# EAGLE design clock (EAGLE 6.5.0)
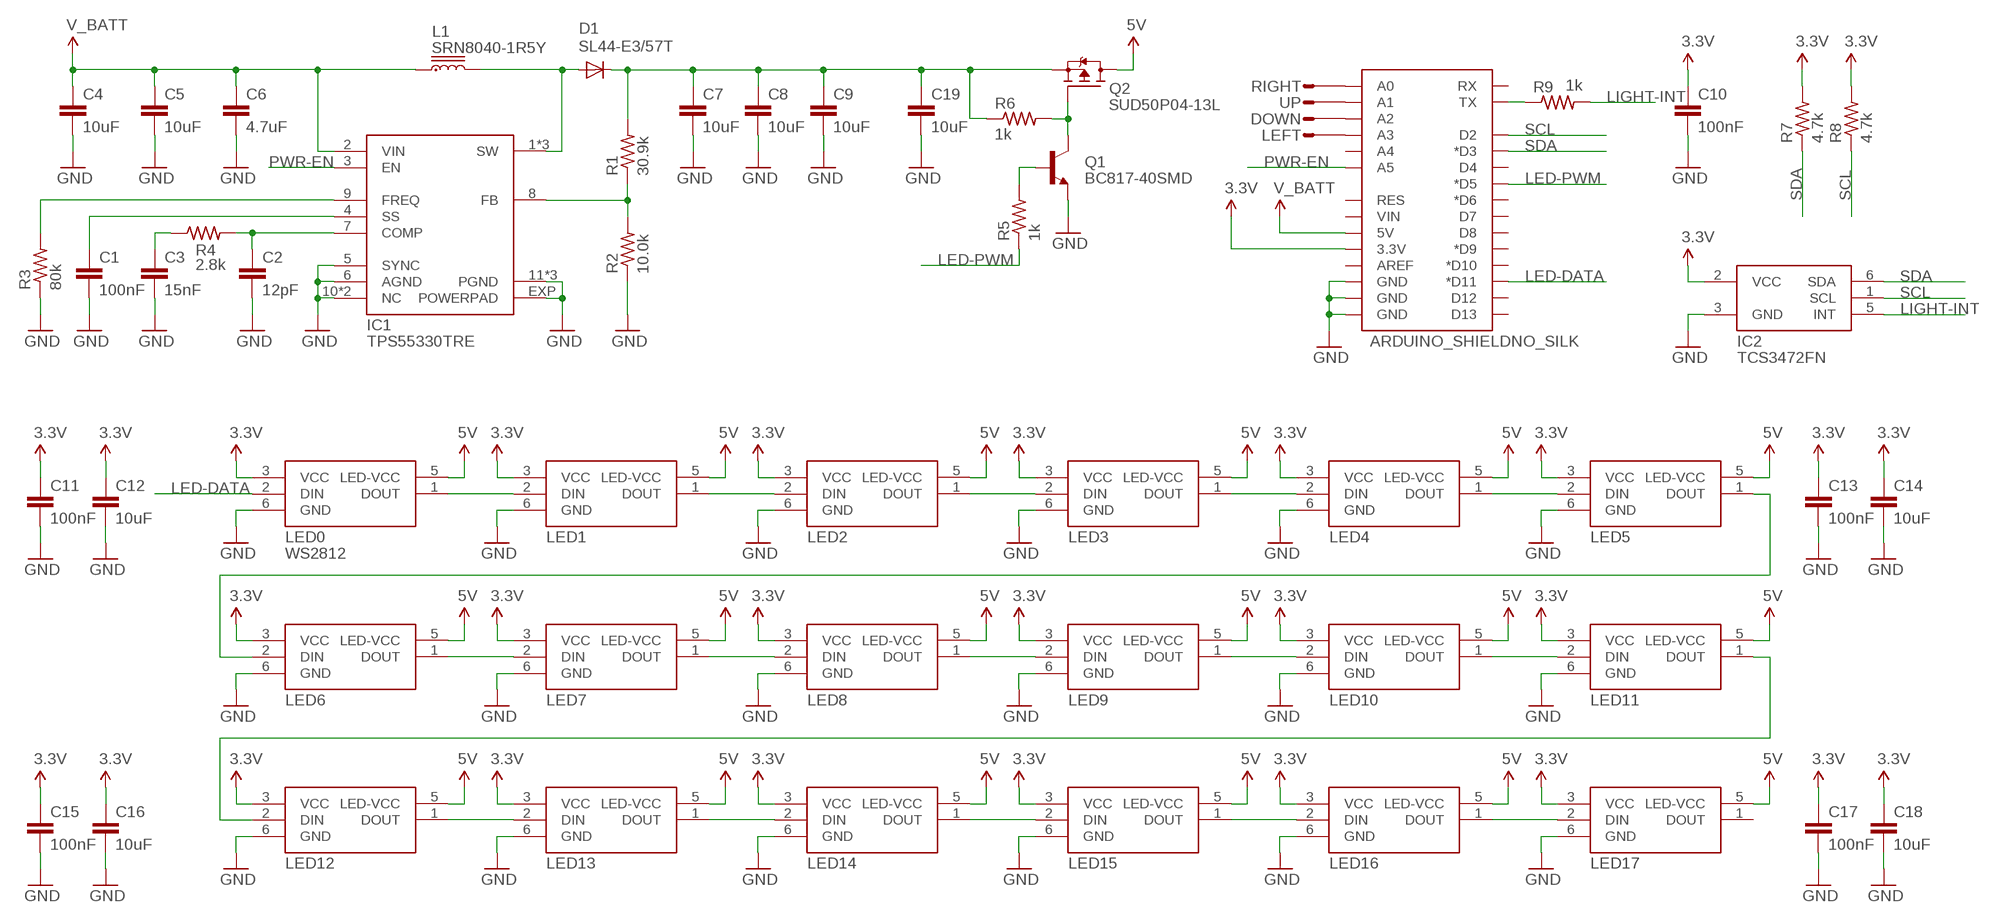
[diagram p0: schematic, sheet 1]

## Parts
C1  100nF  C-EUC0603K  [C0603K]
C2  12pF  C-EUC0603K  [C0603K]
C3  15nF  C-EUC0603K  [C0603K]
C4  10uF  C-EUC1206K  [C1206K]
C5  10uF  C-EUC1206K  [C1206K]
C6  4.7uF  C-EUC0805K  [C0805K]
C7  10uF  C-EUC1206K  [C1206K]
C8  10uF  C-EUC1206K  [C1206K]
C9  10uF  C-EUC1206K  [C1206K]
C10  100nF  C-EUC0603K  [C0603K]
C11  100nF  C-EUC0603K  [C0603K]
C12  10uF  C-EUC1206K  [C1206K]
C13  100nF  C-EUC0603K  [C0603K]
C14  10uF  C-EUC1206K  [C1206K]
C15  100nF  C-EUC0603K  [C0603K]
C16  10uF  C-EUC1206K  [C1206K]
C17  100nF  C-EUC0603K  [C0603K]
C18  10uF  C-EUC1206K  [C1206K]
C19  10uF  C-EUC1206K  [C1206K]
CN1  ARDUINO_SHIELDNO_SILK  [DUEMILANOVE_VIAS]
D1  SL44-E3/57T  DIODE-SMC  [SMC]
DOWN  CAP-PAD15MM  [CAP-PAD-15MM]
IC1  TPS55330TRE  [QFN16]
IC2  TCS3472FN  [DFN-6]
L1  SRN8040-1R5Y  SRN8040  [SRN8040]
LED0  WS2812  [LED-TRICOLOR-5050-IC]
LED1  WS2812  [LED-TRICOLOR-5050-IC]
LED2  WS2812  [LED-TRICOLOR-5050-IC]
LED3  WS2812  [LED-TRICOLOR-5050-IC]
LED4  WS2812  [LED-TRICOLOR-5050-IC]
LED5  WS2812  [LED-TRICOLOR-5050-IC]
LED6  WS2812  [LED-TRICOLOR-5050-IC]
LED7  WS2812  [LED-TRICOLOR-5050-IC]
LED8  WS2812  [LED-TRICOLOR-5050-IC]
LED9  WS2812  [LED-TRICOLOR-5050-IC]
LED10  WS2812  [LED-TRICOLOR-5050-IC]
LED11  WS2812  [LED-TRICOLOR-5050-IC]
LED12  WS2812  [LED-TRICOLOR-5050-IC]
LED13  WS2812  [LED-TRICOLOR-5050-IC]
LED14  WS2812  [LED-TRICOLOR-5050-IC]
LED15  WS2812  [LED-TRICOLOR-5050-IC]
LED16  WS2812  [LED-TRICOLOR-5050-IC]
LED17  WS2812  [LED-TRICOLOR-5050-IC]
LEFT  CAP-PAD15MM  [CAP-PAD-15MM]
Q1  BC817-40SMD  [SOT23-BEC]
Q2  SUD50P04-13L  FDD4141TO252  [TO252]
R1  30.9k  R-US_R0603  [R0603]
R2  10.0k  R-US_R0603  [R0603]
R3  80k  R-US_R0603  [R0603]
R4  2.8k  R-US_R0603  [R0603]
R5  1k  R-US_R0603  [R0603]
R6  1k  R-US_R0603  [R0603]
R7  4.7k  R-US_R0603  [R0603]
R8  4.7k  R-US_R0603  [R0603]
R9  1k  R-US_R0603  [R0603]
RIGHT  CAP-PAD15MM  [CAP-PAD-15MM]
UP  CAP-PAD15MM  [CAP-PAD-15MM]

## Nets
3.3V: C10.1 C11.1 C12.1 C13.1 C14.1 C15.1 C16.1 C17.1 C18.1 CN1.3.3V IC2.2(VCC) LED0.3(VCC) LED1.3(VCC) LED2.3(VCC) LED3.3(VCC) LED4.3(VCC) LED5.3(VCC) LED6.3(VCC) LED7.3(VCC) LED8.3(VCC) LED9.3(VCC) LED10.3(VCC) LED11.3(VCC) LED12.3(VCC) LED13.3(VCC) LED14.3(VCC) LED15.3(VCC) LED16.3(VCC) LED17.3(VCC) R7.2 R8.2
5V: LED0.5(LED-VCC) LED1.5(LED-VCC) LED2.5(LED-VCC) LED3.5(LED-VCC) LED4.5(LED-VCC) LED5.5(LED-VCC) LED6.5(LED-VCC) LED7.5(LED-VCC) LED8.5(LED-VCC) LED9.5(LED-VCC) LED10.5(LED-VCC) LED11.5(LED-VCC) LED12.5(LED-VCC) LED13.5(LED-VCC) LED14.5(LED-VCC) LED15.5(LED-VCC) LED16.5(LED-VCC) LED17.5(LED-VCC) Q2.3(D)
COMP: C2.1 IC1.7(COMP) R4.2
FB: IC1.8(FB) R1.1 R2.2
FREQ: IC1.9(FREQ) R3.2
GND: C1.2 C2.2 C3.2 C4.2 C5.2 C6.2 C7.2 C8.2 C9.2 C10.2 C11.2 C12.2 C13.2 C14.2 C15.2 C16.2 C17.2 C18.2 C19.2 CN1.GND@0(GND) CN1.GND@1(GND) CN1.GND@2(GND) IC1.5(SYNC) IC1.6(AGND) IC1.10(NC) IC1.11(PGND) IC1.12(PGND) IC1.13(PGND) IC1.14(NC) IC1.EXP(POWERPAD) IC2.3(GND) LED0.6(GND) LED1.6(GND) LED2.6(GND) LED3.6(GND) LED4.6(GND) LED5.6(GND) LED6.6(GND) LED7.6(GND) LED8.6(GND) LED9.6(GND) LED10.6(GND) LED11.6(GND) LED12.6(GND) LED13.6(GND) LED14.6(GND) LED15.6(GND) LED16.6(GND) LED17.6(GND) Q1.E R2.1 R3.1
LED12: LED12.1(DOUT) LED13.2(DIN)
LED15: LED14.1(DOUT) LED15.2(DIN)
LED-DATA: CN1.D11(*D11) LED0.2(DIN)
LED-PWM: CN1.D5(*D5) R5.1
LIGHT-INT: IC2.5(INT) R9.2
N$1: CN1.A3 LEFT.P$1
N$2: CN1.A2 DOWN.P$1
N$3: CN1.A1 UP.P$1
N$4: CN1.A0 RIGHT.P$1
N$5: LED0.1(DOUT) LED1.2(DIN)
N$6: CN1.TX R9.1
N$7: C3.1 R4.1
N$8: Q1.B R5.2
N$9: Q1.C Q2.1(G) R6.2
N$10: LED1.1(DOUT) LED2.2(DIN)
N$11: LED2.1(DOUT) LED3.2(DIN)
N$12: LED3.1(DOUT) LED4.2(DIN)
N$13: LED4.1(DOUT) LED5.2(DIN)
N$14: LED6.1(DOUT) LED7.2(DIN)
N$15: LED7.1(DOUT) LED8.2(DIN)
N$16: LED8.1(DOUT) LED9.2(DIN)
N$17: LED9.1(DOUT) LED10.2(DIN)
N$18: LED10.1(DOUT) LED11.2(DIN)
N$19: LED5.1(DOUT) LED6.2(DIN)
N$21: LED13.1(DOUT) LED14.2(DIN)
N$23: LED15.1(DOUT) LED16.2(DIN)
N$24: LED16.1(DOUT) LED17.2(DIN)
N$25: LED11.1(DOUT) LED12.2(DIN)
PWR-EN: CN1.A5 IC1.3(EN)
SCL: CN1.D2 IC2.1(SCL) R8.1
SDA: CN1.D3(*D3) IC2.6(SDA) R7.1
SMPSU-OUTPUT: C7.1 C8.1 C9.1 C19.1 D1.C Q2.2(S) R1.2 R6.1
SS: C1.1 IC1.4(SS)
SW: D1.A IC1.1(SW) IC1.15(SW) IC1.16(SW) L1.P$2
V_BATT: C4.1 C5.1 C6.1 CN1.5V IC1.2(VIN) L1.P$1
Unconnected: CN1.A4 CN1.AREF CN1.D4 CN1.D6(*D6) CN1.D7 CN1.D8 CN1.D9(*D9) CN1.D10(*D10) CN1.D12 CN1.D13 CN1.RES CN1.RX CN1.VIN LED17.1(DOUT)

## Library data of the parts
C1-C19 = rcl:C-EU: CAPACITOR, European symbol
CN1 = SparkFun-Boards:ARDUINO_SHIELD: Arduino shield footprint
D1 = diode:DIODE-: DIODE
DOWN LEFT RIGHT UP = HyperTriangle:CAP-PAD: Capacitive Pad
IC1 = HyperTriangle:TPS55330: The TPS55330 is a monolithic non-synchronous switching regulator with integrated 5-A, 24-V power switch. It can be configured in several standard switching-regulator topologies, including boost, SEPIC and isolated flyback. The device has a wide input voltage range to support applications with input voltage from multi-cell batteries or regulated 3.3-V, 5-V, and 12-V power rails.
IC2 = HyperTriangle:TCS3472: The TAOS inc. TCS3472 device provides a digital return of red, green, blue (RGB), and clear light sensing values. An IR blocking filter, integrated on-chip and localized to the color sensing photodiodes, minimizes the IR spectral wide component dynamic of the range, incoming and IR light blocking and allows filter make color measurements the TCS3472 an to ideal be made color accurately. sensor solution The high for sensitivity, use under varying lighting conditions and through attenuating materials. The TCS3472 color sensor has a wide range of applications including RGB LED backlight control, solid-state lighting, IR blocking health/fitness filter enables products, the TCS3472 industrial to perform processambient controls light and sensing medical (ALS). diagnostic Ambient equipment. light sensing In addition, is widely the used enable inautomatic display-based display products brightness such for as cell optimal phones, viewing notebooks, and power and savings. TVs to sense The TCS3472, the lighting itself, environment can enter and lower-power wait state between light sensing measurements to further reduce the average power consumption.
L1 = HyperTriangle:SRN8040: SRN8040 Series - Semi-shielded Power Inductors
LED0 LED1-LED17 = HyperTriangle:WS2812: RGB 5050 LED with integrated WS2811 controller
Q1 = transistor-npn:BC817*: NPN Transistor
Q2 = transistor-fet:FDD4141: P-Channel PowerTrench® MOSFET Source: FDD4141.pdf
R1-R9 = rcl:R-US_: RESISTOR, American symbol

## Board
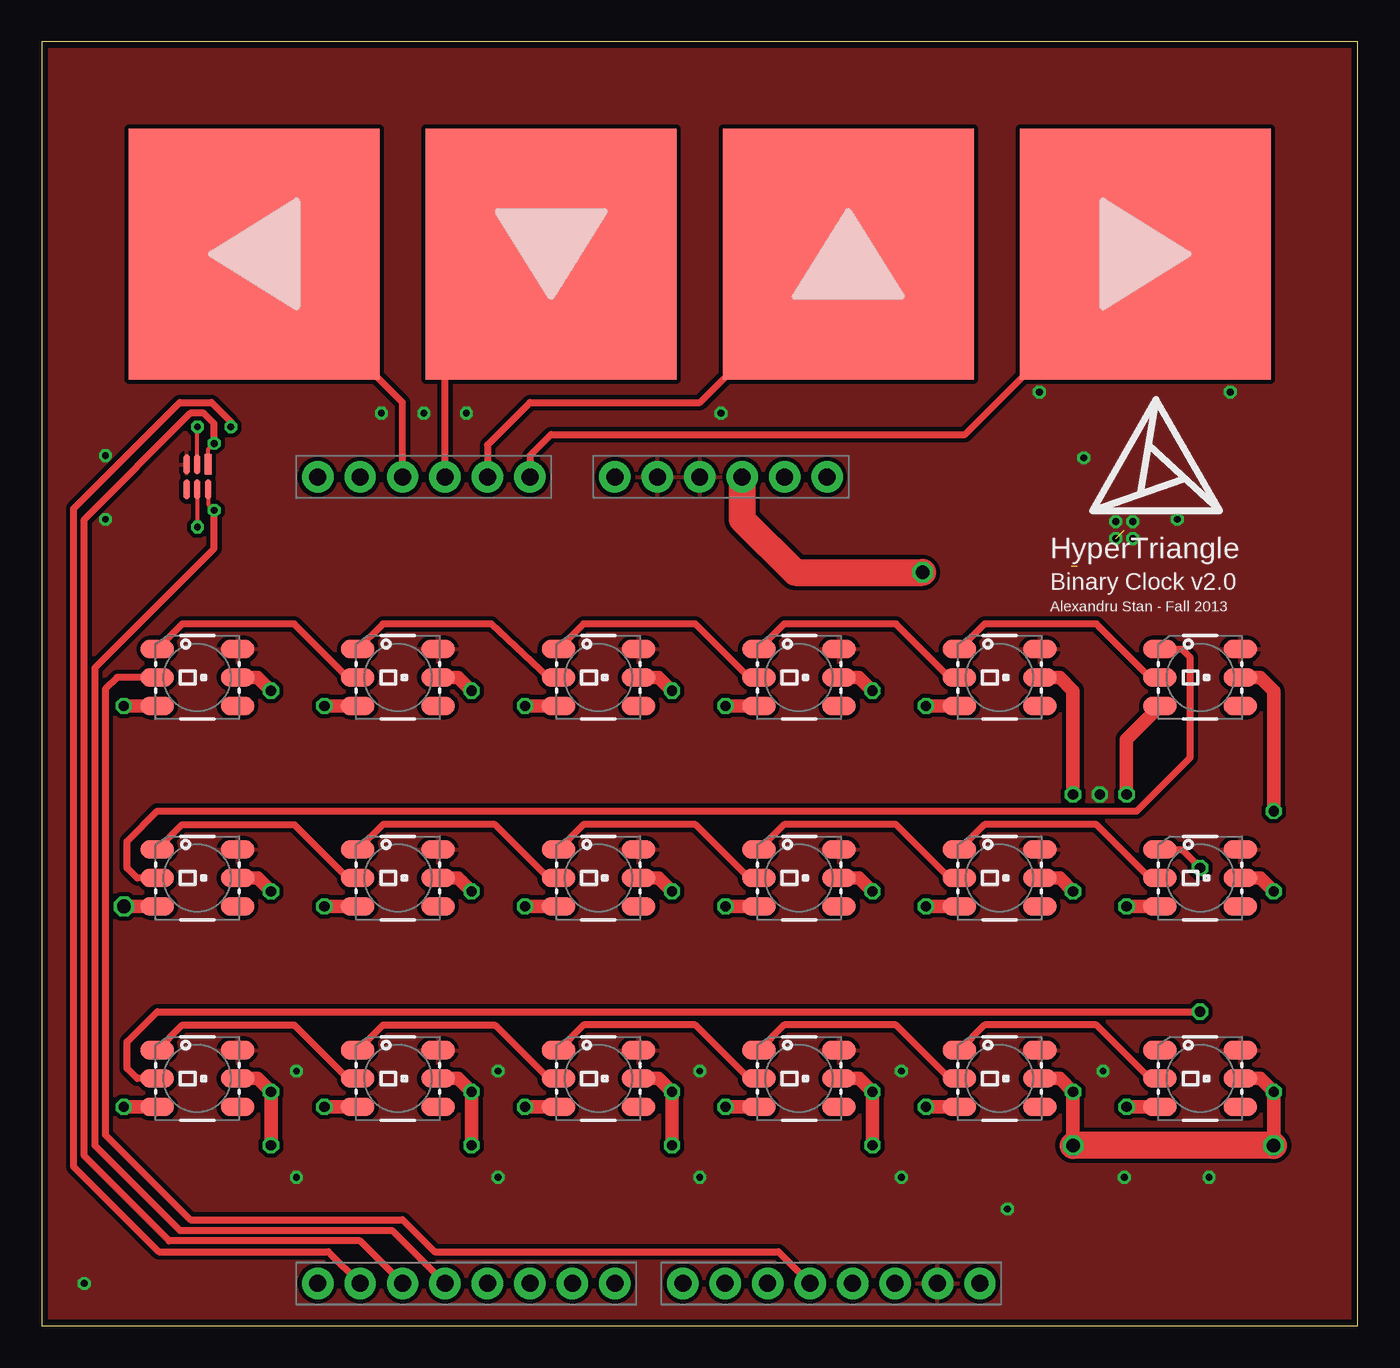
[diagram p1: board, top side]
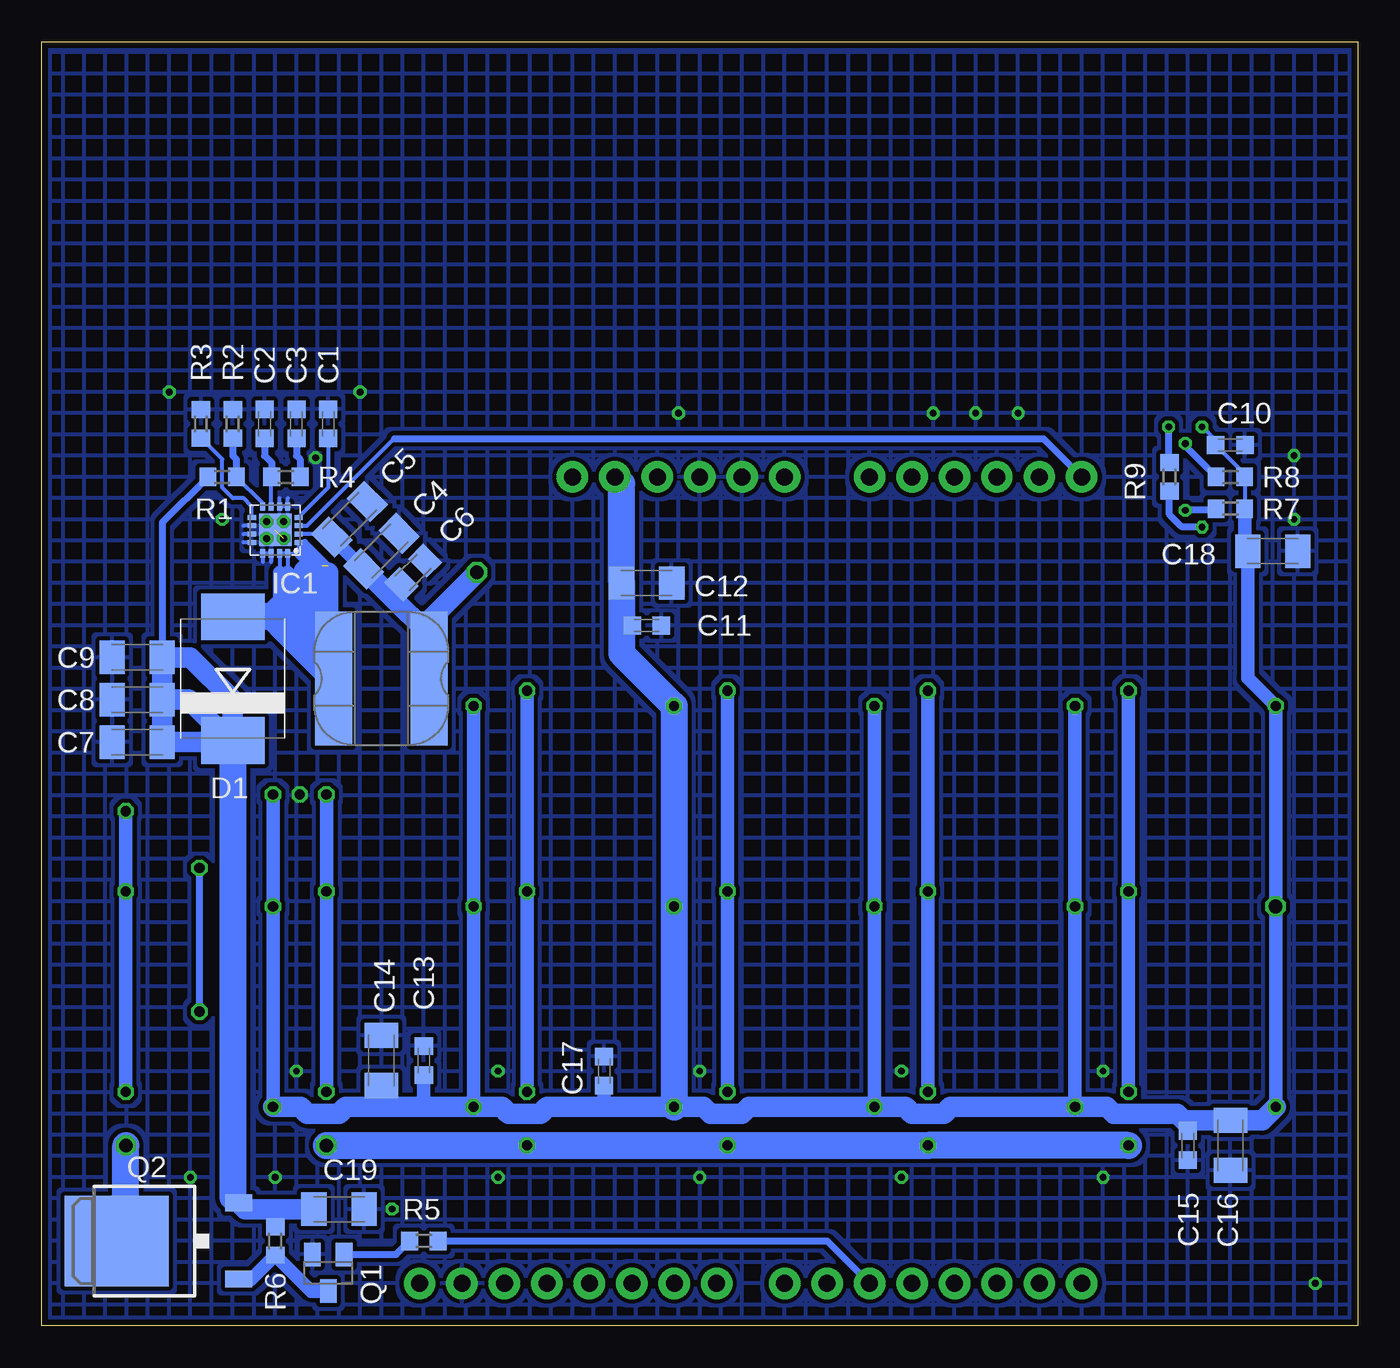
[diagram p2: board, bottom side, seen from below]

Size 78.74 x 76.83 mm. Coordinates in mm from the lower left corner, seen from the top.
Outline: 0,0 78.74,0 78.74,76.83 0,76.83 0,0
Copper layers (1*16): Top 0.0356mm / dielectric 1.5011mm / Bottom 0.0356mm
Design rules "LaenPCBOrder *": minimum track width 6mil, minimum drill 13mil, track to track 6mil, track to pad 6mil, pad to pad 6mil, via to via 6mil, smd to smd 6mil, copper to edge 15mil, drill to drill 6mil, minimum pad ring 7mil, minimum via ring 7mil, stop-mask expansion 3mil, vias tented up to drill 32mil, thermal gap 10mil

### Footprints (pad centres in the part's own frame; a part is rotated, then mirrored left to right if it is on the bottom)
C0603K = smd 1.05 x 1.08: 1 -0.875,0; 2 0.875,0
C1206K = smd 1.5 x 2: 1 -1.5,0; 2 1.5,0
C0805K = smd 1.3 x 1.6: 1 -1,0; 2 1,0
DUEMILANOVE_VIAS = drill 1.016 pad 1.88: 3.3V 50.8,13.97; 5V 50.8,16.51; A0 50.8,29.21; A1 50.8,31.75; A2 50.8,34.29; A3 50.8,36.83; A4 50.8,39.37; A5 50.8,41.91; AREF 2.54,2.286; D2 2.54,36.83; D3 2.54,34.29; D4 2.54,31.75; D5 2.54,29.21; D6 2.54,26.67; D7 2.54,24.13; D8 2.54,20.066; D9 2.54,17.526; D10 2.54,14.986; D11 2.54,12.446; D12 2.54,9.906; D13 2.54,7.366; GND@0 50.8,19.05; GND@1 50.8,21.59; GND@2 2.54,4.826; RES 50.8,11.43; RX 2.54,41.91; TX 2.54,39.37; VIN 50.8,24.13
SMC = smd 2.8 x 3.8: A 3.7,0; C -3.7,0
CAP-PAD-15MM = smd 15 x 15: P$1 0,0
QFN16 = smd 0.5 x 0.3: 1 -1.4,0.75; 2 -1.4,0.25; 3 -1.4,-0.25; 4 -1.4,-0.75; 9 1.4,-0.75; 10 1.4,-0.25; 11 1.4,0.25; 12 1.4,0.75 | smd 0.3 x 0.5: 5 -0.75,-1.4; 6 -0.25,-1.4; 7 0.25,-1.4; 8 0.75,-1.4; 13 0.75,1.4; 14 0.25,1.4; 15 -0.25,1.4; 16 -0.75,1.4 | smd 1.95 x 1.95: EXP 0,0
DFN-6 = smd 1.2 x 0.4: 1 -0.75,0.65; 2 -0.75,0; 3 -0.75,-0.65; 4 0.75,-0.65; 5 0.75,0; 6 0.75,0.65
SRN8040 = smd 2.2 x 8: P$1 -2.85,0; P$2 2.85,0
LED-TRICOLOR-5050-IC = smd 2 x 1.1: 1 -2.4,1.7; 2 -2.4,0; 3 -2.4,-1.7; 4 2.4,-1.7; 5 2.4,0; 6 2.4,1.7
SOT23-BEC = smd 1 x 1.4: B -0.95,-1.1; C 0,1.1; E 0.95,-1.1
TO252 = smd 1 x 1.6: 1 -2.28,-4.8; 2 2.28,-4.8 | smd 5.4 x 6.2: 3 0,2.5
R0603 = smd 1 x 1.1: 1 -0.85,0; 2 0.85,0

### Placement (x,y rotation side)
C1  61.59,53.98 90 bottom
C2  65.41,53.98 90 bottom
C3  63.5,53.98 90 bottom
C4  58.42,46.35 45 bottom
C5  60.33,48.26 45 bottom
C6  56.52,45.09 45 bottom
C7  73.03,34.92 180 bottom
C8  73.03,37.47 180 bottom
C9  73.03,40.01 180 bottom
C10  7.62,52.7 0 bottom
C11  42.55,41.91 0 bottom
C12  42.55,44.45 0 bottom
C13  55.88,15.88 90 bottom
C14  58.42,15.88 90 bottom
C15  10.16,10.79 270 bottom
C16  7.62,10.79 270 bottom
C17  45.09,15.24 90 bottom
C18  5.08,46.35 0 bottom
C19  60.96,6.99 0 bottom
CN1  58.42,0 90 top
D1  67.31,38.73 90 bottom
DOWN  30.48,64.14 0 top
IC1  64.77,47.62 180 bottom
IC2  9.31,50.8 270 top
L1  58.42,38.73 180 bottom
LED0  9.31,38.8 0 top
LED1  21.31,38.8 0 top
LED2  33.31,38.8 0 top
LED3  45.31,38.8 0 top
LED4  57.31,38.8 0 top
LED5  69.31,38.8 0 top
LED6  9.31,26.8 0 top
LED7  21.31,26.8 0 top
LED8  33.31,26.8 0 top
LED9  45.31,26.8 0 top
LED10  57.31,26.8 0 top
LED11  69.31,26.8 0 top
LED12  9.31,14.8 0 top
LED13  21.31,14.8 0 top
LED14  33.31,14.8 0 top
LED15  45.31,14.8 0 top
LED16  57.31,14.8 0 top
LED17  69.31,14.8 0 top
LEFT  12.7,64.14 0 top
Q1  61.59,3.17 180 bottom
Q2  71.75,5.08 90 bottom
R1  67.94,50.8 180 bottom
R2  67.31,53.98 270 bottom
R3  69.22,53.98 270 bottom
R4  64.14,50.8 180 bottom
R5  55.88,5.08 180 bottom
R6  64.77,5.08 270 bottom
R7  7.62,48.9 0 bottom
R8  7.62,50.8 0 bottom
R9  11.27,50.8 270 bottom
RIGHT  66.04,64.14 0 top
UP  48.26,64.14 0 top

### Tracks (layer width: path | path; a pad name or v marks a point on that pad's centre or on a via)
3.3V  (via drill 0.41, 0.61, 0.81 pad 0.61)
  Top 0.254: IC2.2 v9.31,53.8
  Top 0.813: LED0.3 v4.91,37.1 | LED1.3 v16.91,37.1 | LED2.3 v28.91,37.1 | LED3.3 v40.91,37.1 | LED4.3 v52.91,37.1 | LED11.3 v64.91,25.1 | LED10.3 v52.91,25.1 | LED9.3 v40.91,25.1 | LED8.3 v28.91,25.1 | LED7.3 v16.91,25.1 | LED12.3 v4.91,13.1 | LED13.3 v16.91,13.1 | LED14.3 v28.91,13.1 | LED15.3 v40.91,13.1 | LED16.3 v52.91,13.1 | LED17.3 v64.91,13.1 | LED5.3 64.91,35.1 v64.91,31.8 | LED6.3 v4.91,25.1
  Bottom 0.254: R7.2 R8.2 6.77,50.98 C10.1 8.5,52.98 v9.31,53.8
  Bottom 0.813: v64.91,31.8 v64.91,25.1 v64.91,13.1 | v16.91,37.1 v16.91,25.1 v16.91,13.1 | v52.91,37.1 v52.91,25.1 v52.91,13.1 | v28.91,37.1 v28.91,25.1 v28.91,13.1 | C11.1 44.05,41.91 | C15.1 10.16,12.29 | R7.2 6.77,46.55 C18.1 6.58,38.77 v4.91,37.1 v4.91,25.1 v4.91,13.1 | C17.1 45.09,13.1 | C13.1 55.88,13.1
  Bottom 1.219: v64.91,13.1 63.27,13.1 62.86,12.7 60.96,12.7 60.56,13.1 58.42,13.1 | 58.42,13.1 55.88,13.1 v52.91,13.1 51.2,13.1 50.8,12.7 48.89,12.7 48.49,13.1 45.09,13.1 v40.91,13.1 39.13,13.1 38.73,12.7 36.83,12.7 36.43,13.1 v28.91,13.1 27.07,13.1 26.67,12.7 24.77,12.7 24.37,13.1 v16.91,13.1 15,13.1 14.61,12.7 10.79,12.7 10.39,12.29 10.16,12.29 C16.1 5.71,12.29 v4.91,13.1 | C14.1 58.42,13.1
  Bottom 1.626: v40.91,13.1 v40.91,25.1 v40.91,37.1 44.05,40.23 44.05,41.91 C12.1 44.05,50.4 CN1.3.3V
5V  (via drill 0.61, 0.81)
  Top 0.813: LED0.5 12.91,38.8 v13.71,38 | LED1.5 24.91,38.8 v25.71,38 | LED2.5 36.91,38.8 v37.71,38 | LED3.5 48.91,38.8 v49.71,38 | LED5.5 72.91,38.8 73.71,38 v73.71,30.8 | LED11.5 72.91,26.8 v73.71,26 | LED10.5 60.91,26.8 v61.71,26 | LED9.5 48.91,26.8 v49.71,26 | LED8.5 36.91,26.8 v37.71,26 | LED7.5 24.91,26.8 v25.71,26 | LED6.5 12.91,26.8 v13.71,26 | LED12.5 12.91,14.8 v13.71,14 v13.71,10.8 | LED13.5 24.91,14.8 v25.71,14 v25.71,10.8 | LED14.5 36.91,14.8 v37.71,14 v37.71,10.8 | LED15.5 48.91,14.8 v49.71,14 v49.71,10.8 | LED16.5 60.91,14.8 v61.71,14 v61.71,10.8 | LED17.5 72.91,14.8 v73.71,14 v73.71,10.8 | LED4.5 60.91,38.8 61.71,38 v61.71,31.8
  Top 1.626: v73.71,10.8 v61.71,10.8
  Bottom 0.813: v25.71,38 v25.71,26 v25.71,14 | v37.71,14 v37.71,26 v37.71,38 | v49.71,38 v49.71,26 v49.71,14 | v61.71,14 v61.71,26 v61.71,31.8 | v73.71,30.8 v73.71,26 v73.71,14 | v13.71,38 v13.71,26 v13.71,14
  Bottom 1.626: v61.71,10.8 v49.71,10.8 v37.71,10.8 v25.71,10.8 v13.71,10.8 | Q2.3 73.71,5.62 v73.71,10.8
COMP
  Bottom 0.254: IC1.7 65.02,50.77 R4.2
  Bottom 0.406: C2.1 65.41,52.07 64.98,51.65 R4.2
FB
  Bottom 0.254: IC1.8 65.52,49.23 R1.1
  Bottom 0.406: R2.2 67.31,52.07 67.09,51.85 R1.1
FREQ
  Bottom 0.254: IC1.9 66.17,49.02 66.67,49.53 67.31,49.53 67.94,50.16 67.94,51.85 R3.2
GND  (via drill 0.41 pad 0.41, 0.61 pad 0.41)  (1 unrouted)
  Bottom 0.254: 65.02,45.72 IC1.14 IC1.13 65.52,45.72 | 64.52,49.53 IC1.6 IC1.5 64.02,49.53 | IC1.12 66.67,46.88 | IC1.11 66.67,47.38 | IC1.10 66.67,47.88
  other vias: 64.26,48.13 65.28,48.13 64.26,47.12 65.28,47.12 62.36,51.94 67.94,48.26 59.69,55.88 71.12,55.88 57.78,6.99 3.81,48.26 63.31,31.8 15.24,15.24 27.3,15.24 39.37,15.24 51.44,15.24 63.5,15.24 64.77,8.89 69.85,8.89 39.37,8.89 51.44,8.89 27.3,8.89 15.24,8.89 2.54,2.54 3.81,52.07 40.64,54.61 25.4,54.61 22.86,54.61 20.32,54.61
  pour Bottom (isolate 0.254, hatched): 0,76.83 78.74,76.83 78.74,0 0,0
  pour Top (isolate 0.254): 0,76.83 78.74,76.83 78.74,0 0,0
LED12
  Top 0.406: LED12.1 8.41,18 15.11,18 18.31,14.8 LED13.2
LED15
  Top 0.406: LED15.2 42.31,14.8 39.11,18 32.41,18 LED14.1
LED-DATA
  Top 0.406: LED0.2 4.51,38.8 3.81,38.1 3.81,11.43 8.89,6.35 21.59,6.35 23.49,4.45 44.07,4.45 CN1.D11
LED-PWM
  Bottom 0.406: R5.1 31.75,5.08 CN1.D5
LIGHT-INT  (via drill 0.41 pad 0.41)
  Top 0.254: IC2.5 v9.31,47.8
  Bottom 0.406: v9.31,47.8 10.51,47.8 11.27,48.55 R9.2
N$1
  Top 0.406: CN1.A3 21.59,55.24 LEFT.P$1
N$2
  Top 0.406: CN1.A2 24.13,57.78 DOWN.P$1
N$3
  Top 0.406: UP.P$1 39.37,55.24 29.21,55.24 26.67,52.7 CN1.A1
N$4
  Top 0.406: RIGHT.P$1 55.25,53.34 30.48,53.34 29.21,52.07 CN1.A0
N$5
  Top 0.406: LED0.1 8.41,42 15.11,42 18.31,38.8 LED1.2
N$6  (via drill 0.41 pad 0.61)
  Top 0.406: v11.31,53.8 11.31,54.09 10.16,55.24 8.25,55.24 1.9,48.9 1.9,9.53 6.98,4.45 17.14,4.45 CN1.TX
  Bottom 0.406: R9.1 11.31,51.7 v11.31,53.8
N$7
  Bottom 0.406: C3.1 63.5,52.07 63.28,51.85 R4.1
N$8
  Bottom 0.406: Q1.B 57.53,4.28 R5.2
N$9
  Bottom 0.813: Q2.1 66.2,2.8 R6.2 62.61,2.08 Q1.C
N$10
  Top 0.406: LED1.1 20.41,42 26.91,42 30.31,38.8 LED2.2
N$11
  Top 0.406: LED3.2 42.31,38.8 39.11,42 32.41,42 LED2.1
N$12
  Top 0.406: LED4.2 54.31,38.8 51.11,42 44.41,42 LED3.1
N$13
  Top 0.406: LED5.2 66.31,38.8 63.11,42 56.41,42 LED4.1
N$14
  Top 0.406: LED6.1 8.41,30 15.11,30 18.31,26.8 LED7.2
N$15
  Top 0.406: LED8.2 30.31,26.8 27.11,30 20.41,30 LED7.1
N$16
  Top 0.406: LED9.2 42.31,26.8 39.11,30 32.41,30 LED8.1
N$17
  Top 0.406: LED10.2 54.31,26.8 51.11,30 44.41,30 LED9.1
N$18
  Top 0.406: LED11.2 66.31,26.8 63.11,30 56.41,30 LED10.1
N$19
  Top 0.406: LED5.1 68.21,40.5 68.71,40 68.71,34 65.51,30.8 6.91,30.8 5.11,29 5.11,27.4 5.71,26.8 LED6.2
N$21
  Top 0.406: LED13.1 20.41,18 27.11,18 30.31,14.8 LED14.2
N$23
  Top 0.406: LED16.2 54.31,14.8 51.11,18 44.41,18 LED15.1
N$24
  Top 0.406: LED17.2 66.31,14.8 63.11,18 56.41,18 LED16.1
N$25  (via drill 0.61)
  Top 0.406: LED12.2 5.71,14.8 5.11,15.4 5.11,17 6.91,18.8 v69.31,18.8 | LED11.1 68.21,28.5 v69.31,27.4
  Bottom 0.406: v69.31,27.4 v69.31,18.8
PWR-EN
  Bottom 0.254: IC1.3 62.87,47.88 57.66,53.09
  Bottom 0.406: 57.66,53.09 18.8,53.09 CN1.A5
SCL  (via drill 0.41)
  Top 0.254: IC2.1 9.96,52.45 v10.31,52.8
  Top 0.406: v10.31,52.8 10.31,54 9.7,54.61 8.89,54.61 2.54,48.26 2.54,10.16 7.62,5.08 19.05,5.08 CN1.D2
  Bottom 0.406: R8.1 10.31,52.64 v10.31,52.8
SDA  (via drill 0.41)
  Top 0.254: IC2.6 9.96,49.15 v10.31,48.8
  Top 0.406: v10.31,48.8 10.31,46.51 3.17,39.37 3.17,10.79 8.25,5.71 20.95,5.71 CN1.D3
  Bottom 0.406: R7.1 8.56,48.8 v10.31,48.8
SMPSU-OUTPUT
  Bottom 0.406: R1.2 71.53,48.07 C9.1
  Bottom 0.813: 67.31,7.71 Q2.2 | R6.1 64.77,6.99
  Bottom 1.219: 71.53,35.03 C7.1 | 67.42,34.92 D1.C 67.31,37.47 69.85,40.01 C9.1 C8.1 | 67.42,34.92 C7.1 | 67.42,34.92 69.96,37.47 C8.1 | C19.1 64.77,6.99 66.58,6.99 Q2.2 | C7.1 C8.1
  Bottom 1.626: D1.C 67.31,7.71
SS
  Bottom 0.254: C1.1 61.59,50.16 IC1.4
SW  (1 unrouted)
  Bottom 0.254: 63,46.88 IC1.1 63.37,46.23 IC1.16 | IC1.16 IC1.15 64.52,45.09 | IC1.16 64.02,45.09 | 61.59,45.47 61.59,45.09 | 62.86,45.72 62.86,45.09
  Bottom 0.406: 63,46.88 61.59,45.47
  Bottom 0.61: 63.37,46.23 62.86,45.72
  Bottom 0.813: 64.52,42.88 64.52,45.09 | 64.02,41.48 64.02,45.09 | 61.98,45.47 62.99,46.48
  Bottom 1.219: 61.59,45.09 61.59,41.91
  Bottom 1.626: 64.97,42.44 D1.A | 64.97,42.44 64.52,42.88 | L1.P$2 64.02,41.48 64.97,42.44 | 62.86,45.09 62.86,40.64
V_BATT  (via drill 0.81)
  Top 1.626: CN1.5V 41.91,48.26 45.09,45.09 v52.7,45.09
  Bottom 0.254: C5.1 61.56,47.38 IC1.2
  Bottom 0.813: C5.1 C4.1
  Bottom 1.219: v52.7,45.09 55.57,42.22 L1.P$1 55.57,41.38 57.89,43.71 | C4.1 57.89,43.71 | C6.1 57.89,43.71

### Text on the board
tPlace: Binary Clock v2.0 | Alexandru Stan - Fall 2013
tNames: HyperTriangle